# Altium schematic sheet Inductors.SchDoc
size A; SheetNumber: 3; SheetTotal: 8
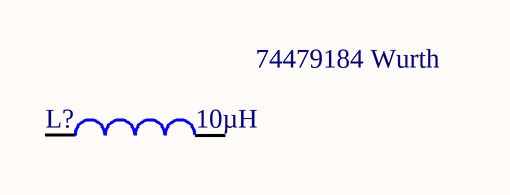
[diagram p0: Inductors.SchDoc]

## Parts
L?  10µH  [WE-MI_1206_L3.2W1.6H1.1]

## Nets

Not connected (* = marked no-connect by the designer): L? 1 2

## Notes on the sheet
- (near L?) 74479184 Wurth

## Library data of the parts
L? = CMP-0221-00030-2: NexarPartId: 23259292; Max DC Current: 25mA; Inductance Tolerance: 10%; Core Material: Ferrite; Shielding: Unshielded; DC Resistance (DCR): 500mΩ; Self Resonant Frequency: 26MHz; Ambient Temperature Range Low: -55°C; RoHS: Compliant; Inductance: 10µH; Tolerance: 10%; Length: 3.2mm; Width: 1.6mm; Case/Package: SMD/SMT; Min Operating Temperature: -55°C; Ambient Temperature Range High: 85°C; Depth: 1.6mm; Current Rating: 25mA; Max Operating Temperature: 125°C; Height: 1.1mm